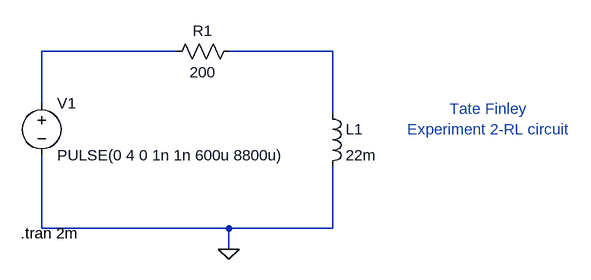
[diagram p0: schematic LC_schematic_ece3060.asc]
LC_schematic_ece3060.asc, the LTspice schematic file:
Version 4
SHEET 1 880 680
WIRE 224 48 16 48
WIRE 464 48 304 48
WIRE 16 128 16 48
WIRE 464 144 464 48
WIRE 16 320 16 208
WIRE 304 320 16 320
WIRE 464 320 464 224
WIRE 464 320 304 320
WIRE 304 352 304 320
FLAG 304 352 0
SYMBOL voltage 16 112 R0
WINDOW 123 0 0 Left 0
WINDOW 39 0 0 Left 0
SYMATTR InstName V1
SYMATTR Value PULSE(0 4 0 1n 1n 600u 8800u)
SYMBOL res 320 32 R90
WINDOW 0 0 56 VBottom 2
WINDOW 3 32 56 VTop 2
SYMATTR InstName R1
SYMATTR Value 200
SYMBOL ind 448 128 R0
SYMATTR InstName L1
SYMATTR Value 22m
TEXT -16 328 Left 2 !.tran 2m
TEXT 704 152 Center 2 ;Tate Finley\nExperiment 2-RL circuit

The netlist it stands for:
* LC_schematic_ece3060.asc
V1 N001 0 PULSE(0 4 0 1n 1n 600u 8800u)
R1 N002 N001 200
L1 N002 0 22m
.tran 2m
* Tate Finley
* Experiment 2-RL circuit
.backanno
.end